# Altium schematic sheet MouseSensor.SchDoc
size Letter; CompanyName: Ploopy Corporation; Organization: Ploopy Corporation; Address1: 137-1140 Burnhamthorpe Road W; Address2: Mississauga; Address3: Ontario; Address4: Canada L5C 0A3; DocumentNumber: 6; Revision: R1.002; SheetNumber: 6; SheetTotal: 8
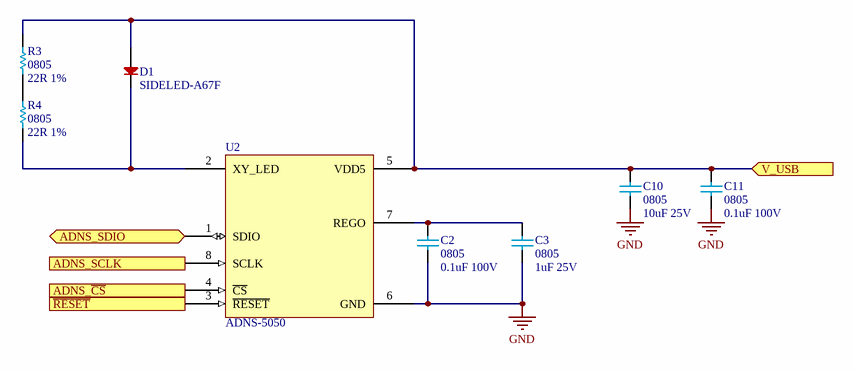
[diagram p0: MouseSensor.SchDoc]

## Parts
C2  0805  value 0.1uF 100V  [0805 - TALL]
C3  0805  value 1uF 25V  [0805 - TALL]
C10  0805  value 10uF 25V  [0805 - TALL]
C11  0805  value 0.1uF 100V  [0805 - TALL]
D1  SIDELED-A67F  [SIDELED-A67F]
R3  0805  value 22R 1%  [0805]
R4  0805  value 22R 1%  [0805]
U2  ADNS-5050  [ADNS-5050]

## Ports
ADNS_SCLK (in), ADNS_SDIO (bidir), ADNS_~{CS} (in), V_USB (in), ~{RESET} (in)

## Nets
GND: C2.1 C3.1 C10.1 C11.1 U2.6(GND)
ADNS_~{CS}: U2.4(~{CS}) ; port ADNS_~{CS}
ADNS_SCLK: U2.8(SCLK) ; port ADNS_SCLK
ADNS_SDIO: U2.1(SDIO) ; port ADNS_SDIO
~{RESET}: U2.3(~{RESET}) ; port ~{RESET}
V_USB: C10.2 C11.2 D1.A R3.2 U2.5(VDD5) ; port V_USB
NetC2_2: C2.2 C3.2 U2.7(REGO)
NetD1_C: D1.C R4.1 U2.2(XY_LED)
NetR3_1: R3.1 R4.2

## Notes on the sheet
- Copyright Ploopy Corporation 2021
- Licensed under the CERN-OHL-S v2
- http://ohwr.org/cernohl
- Title:
- PCB:
- Version:
- Ploopy Corporation
- Mississauga ON L5C 0A3
- 137-1140 Burnhamthorpe Road W
- Date:
- Time:
- Sheet
- of
- Canada

## Library data of the parts
C2 C11 = Cap 0.1uF 100V: 0805, X5R or better; Supplier 1: Digi-Key; Supplier Part Number 1: 1276-6840-2-ND
C3 = Cap 1uF 25V: 0805, X5R or better; Supplier 1: Digi-Key; Supplier Part Number 1: 1276-1066-2-ND; Supplier 2: Digi-Key; Supplier Part Number 2: 1276-1066-1-ND
C10 = Cap 10uF 25V: 0805, X5R or better; Supplier 1: Mouser; Supplier Part Number 1: 81-GRM21BR61E106KA3L; Supplier 2: Digi-Key; Supplier Part Number 2: 490-5523-1-ND
D1 = SIDELED-A67F: Red/Orange/Yellow Side-facing SMT LEDs, high brightness (~2lm); Supplier 2: Digi-Key; Supplier Part Number 2: 475-3415-6-ND; Supplier 1: Digi-Key; Supplier Part Number 1: 475-3392-1-ND
R3 R4 = Res 22R 1% 0805: Chip resistor; Supplier 1: Digi-Key; Supplier 2: Arrow; Supplier Part Number 1: RMCF0805FT22R0CT-ND; Supplier Part Number 2: RMCF0805FT22R0
U2 = ADNS-5050: Optical Mouse Navigation Sensor